# Altium schematic sheet Main_board.SchDoc
size A; SheetNumber: 1; SheetTotal: 5
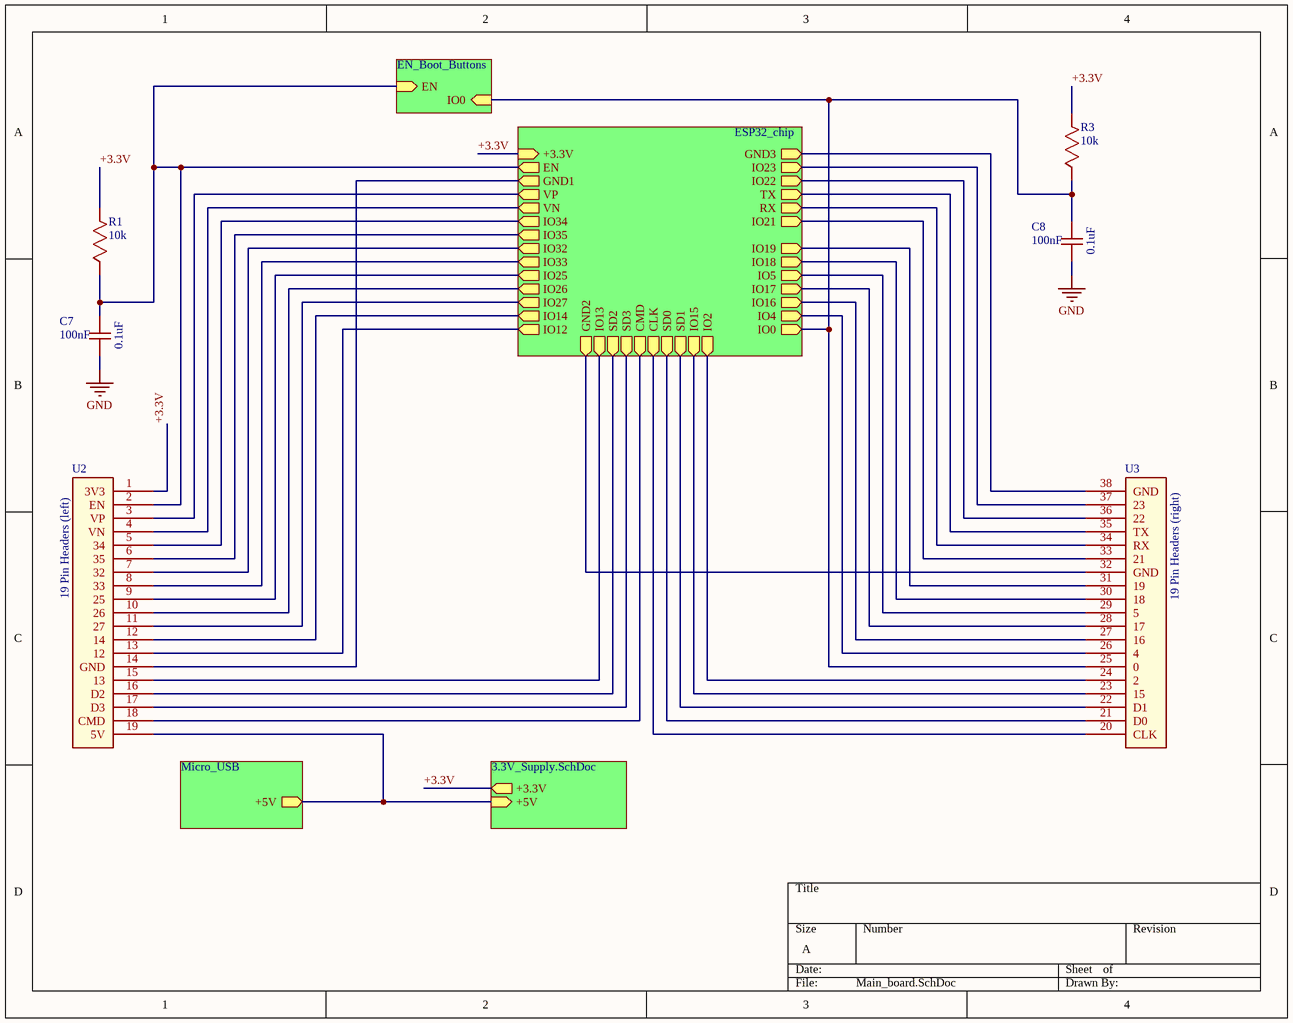
[diagram p0: Main_board.SchDoc]

## Parts
C7  100nF  [CAPC2013X140X45ML15T25]
C8  100nF  [CAPC2013X140X45ML15T25]
R1  10k  [FP-CRGCQ0805-IPC_A]
R3  10k  [FP-CRGCQ0805-IPC_A]
U2  19 Pin Headers (left)  [19 Pin headers]
U3  19 Pin Headers (right)  [19 Pin headers]

## Sub-sheets
Buttons = EN_Boot_Buttons: EN (in), IO0 (in)
Connector = Micro_USB: +5V (out)
Designator = 3.3V_Supply.SchDoc: +5V (in), +3.3V (out)
ESP32 = ESP32_chip: GND1 (out), VP (out), VN (out), IO34 (out), IO35 (out), IO32 (out), IO33 (out), IO25 (out), IO26 (out), IO27 (out), IO14 (out), IO12 (out), GND3 (out), IO23 (out), IO22 (out), TX (out), RX (out), IO21 (out), IO19 (out), IO18 (out), IO5 (out), IO17 (out), IO16 (out), IO4 (out), +3.3V (in), GND2 (out), IO13 (out), SD2 (out), SD3 (out), CMD (out), CLK (out), SD0 (out), SD1 (out), IO15 (out), IO2 (out), IO0 (out), EN (out)

## Nets
GND: C7.1 C8.1
+3.3V: R1.2 R3.2 U2.1(3V3) ; sheet ESP32/+3.3V, sheet Designator/+3.3V
NetC7_2: C7.2 R1.1 U2.2(EN) ; sheet ESP32/EN, sheet Buttons/EN
NetC8_2: C8.2 R3.1 U3.25(0) ; sheet ESP32/IO0, sheet Buttons/IO0
NetU2_3: U2.3(VP) ; sheet ESP32/VP
NetU2_4: U2.4(VN) ; sheet ESP32/VN
NetU2_5: U2.5(34) ; sheet ESP32/IO34
NetU2_6: U2.6(35) ; sheet ESP32/IO35
NetU2_7: U2.7(32) ; sheet ESP32/IO32
NetU2_8: U2.8(33) ; sheet ESP32/IO33
NetU2_9: U2.9(25) ; sheet ESP32/IO25
NetU2_10: U2.10(26) ; sheet ESP32/IO26
NetU2_11: U2.11(27) ; sheet ESP32/IO27
NetU2_12: U2.12(14) ; sheet ESP32/IO14
NetU2_13: U2.13(12) ; sheet ESP32/IO12
NetU2_14: U2.14(GND) ; sheet ESP32/GND1
NetU2_15: U2.15(13) ; sheet ESP32/IO13
NetU2_16: U2.16(D2) ; sheet ESP32/SD2
NetU2_17: U2.17(D3) ; sheet ESP32/SD3
NetU2_18: U2.18(CMD) ; sheet ESP32/CMD
NetU2_19: U2.19(5V) ; sheet Connector/+5V, sheet Designator/+5V
NetU3_20: U3.20(CLK) ; sheet ESP32/CLK
NetU3_21: U3.21(D0) ; sheet ESP32/SD0
NetU3_22: U3.22(D1) ; sheet ESP32/SD1
NetU3_23: U3.23(15) ; sheet ESP32/IO15
NetU3_24: U3.24(2) ; sheet ESP32/IO2
NetU3_26: U3.26(4) ; sheet ESP32/IO4
NetU3_27: U3.27(16) ; sheet ESP32/IO16
NetU3_28: U3.28(17) ; sheet ESP32/IO17
NetU3_29: U3.29(5) ; sheet ESP32/IO5
NetU3_30: U3.30(18) ; sheet ESP32/IO18
NetU3_31: U3.31(19) ; sheet ESP32/IO19
NetU3_32: U3.32(GND) ; sheet ESP32/GND2
NetU3_33: U3.33(21) ; sheet ESP32/IO21
NetU3_34: U3.34(RX) ; sheet ESP32/RX
NetU3_35: U3.35(TX) ; sheet ESP32/TX
NetU3_36: U3.36(22) ; sheet ESP32/IO22
NetU3_37: U3.37(23) ; sheet ESP32/IO23
NetU3_38: U3.38(GND) ; sheet ESP32/GND3

## Notes on the sheet
- (in symbol GCM21BR71E104KA37L) 0.1uF

## Library data of the parts
C7 C8 = GCM21BR71E104KA37L: Ceramic Capacitor, Ceramic, 25V, 10% +Tol, 10% -Tol, X7R, 15% TC, 0.1uF, Surface Mount, 0805; Manufacturer: Murata; Manufacturer Lifecycle Status: NRND; Supplier: DigiKey; Supplier Part Number: 490-14779-1-ND; Manufacturer Part Number: GCM21BR71E104KA37L; RoHS: Compliant; Category: Ceramic Capacitors; Stock: 12316; Pricing: 1=0.35, 10=0.208, 50=0.1528, 100=0.1358, 500=0.10726, 1000=0.09846 (USD); Value: 100nF; Case/Package: 0805; Case Code (Imperial): 0805; Case Code (Metric): 2012; Depth: 1.25mm; Dielectric: X7R; Dielectric Material: Ceramic; Height: 1.25mm; Length: 2mm; Lifecycle Status: NRND; Max Operating Temperature: 125°C; Min Operating Temperature: -55°C; Mounting Technology: Surface Mount; Number of Terminals: 2; Radiation Hardening: No; Ratings: AEC-Q200; REACH SVHC: Yes; Schedule B: 8532240020, 8532240020|8532240020|8532240020|8532240020|8532240020; Termination: SMD/SMT; Tolerance: 10%; Voltage Rating: 25V; Voltage Rating (DC): 25V; Width: 1.25mm; ComponentLink1URL: https://datasheet.octopart.com:443/GCM21BR71E104KA37L-Murata-datasheet-141268656.pdf?src-supplier=Geoflip; ComponentLink1Description: https://datasheet.octopart.com:443/GCM21BR71E104KA37L-Murata-datasheet-141268656.pdf?src-supplier=Geoflip; ComponentLink2URL: https://datasheet.octopart.com:443/GCM21BR71E104KA37L-Murata-datasheet-140660253.pdf?src-supplier=Ciiva; ComponentLink2Description: https://datasheet.octopart.com:443/GCM21BR71E104KA37L-Murata-datasheet-140660253.pdf?src-supplier=Ciiva; ComponentLink3URL: https://datasheet.octopart.com:443/GCM21BR71E104KA37L-Murata-datasheet-138719617.pdf?src-supplier=Ciiva; ComponentLink3Description: https://datasheet.octopart.com:443/GCM21BR71E104KA37L-Murata-datasheet-138719617.pdf?src-supplier=Ciiva; ComponentLink4URL: https://datasheet.octopart.com:443/GCM21BR71E104KA37L-Murata-datasheet-128592896.pdf?src-supplier=X-ON; ComponentLink4Description: https://datasheet.octopart.com:443/GCM21BR71E104KA37L-Murata-datasheet-128592896.pdf?src-supplier=X-ON; ComponentLink5URL: https://datasheet.octopart.com/GCM21BR71E104KA37L-Murata-datasheet-14404970.pdf; ComponentLink5Description: https://datasheet.octopart.com/GCM21BR71E104KA37L-Murata-datasheet-14404970.pdf; ComponentLink6URL: http://sigma.octopart.com:80/reach_statement/Murata-company-16.pdf?src-supplier=Compliance+Statements; ComponentLink6Description: http://sigma.octopart.com:80/reach_statement/Murata-company-16.pdf?src-supplier=Compliance+Statements
R1 R3 = CRGCQ0805J10K: Res Thick Film 0805 10K Ohm 5% 0.125W(1/8W) ±100ppm/C Pad SMD Automotive T/R; Manufacturer: TE Connectivity; Manufacturer Lifecycle Status: ACTIVE; Operating Supply Voltage: 150V; Power Dissipation: 125mW; Value: 10kΩ; Temperature Coefficient: 100ppm/°C; Supplier: DigiKey; Supplier Part Number: A130140CT-ND; Manufacturer Part Number: CRGCQ0805J10K; RoHS: Compliant; Category: Chip SMD Resistors; Stock: 448725; Pricing: 1=0.1, 10=0.031, 25=0.0232, 50=0.0188, 100=0.0153, 250=0.01204, 500=0.01016, 1000=0.00868 (USD); Ambient Temperature Range High: 70°C; China RoHS: Non-Compliant; Composition: Thick Film; Height: 550µm; Lifecycle Status: Production; Max Operating Temperature: 155°C; Min Operating Temperature: -55°C; Mounting Technology: Surface Mount; Number of Terminals: 2; Packaging: Cut Tape; Power Rating: 125mW; REACH SVHC: Yes; Schedule B: 8533210025, 8533210025|8533210025|8533210025|8533210025|8533210025, 8533210045; Tolerance: 5%; Voltage Rating: 150V; Voltage Rating (DC): 150V; Width: 1.25mm; Working Voltage: 150V; ComponentLink1URL: https://datasheet.octopart.com:443/CRGCQ0805J10K-TE-Connectivity-datasheet-114679081.pdf?src-supplier=Master+Electronics; ComponentLink1Description: https://datasheet.octopart.com:443/CRGCQ0805J10K-TE-Connectivity-datasheet-114679081.pdf?src-supplier=Master+Electronics; ComponentLink2URL: https://datasheet.octopart.com:443/2-2176342-5-TE-Connectivity---AMP-datasheet-189108688.pdf?src-supplier=Master+Electronics; ComponentLink2Description: https://datasheet.octopart.com:443/2-2176342-5-TE-Connectivity---AMP-datasheet-189108688.pdf?src-supplier=Master+Electronics; ComponentLink3URL: https://datasheet.octopart.com:443/CRGCQ0805J10K-TE-Connectivity-datasheet-179161841.pdf?src-supplier=IHS; ComponentLink3Description: https://datasheet.octopart.com:443/CRGCQ0805J10K-TE-Connectivity-datasheet-179161841.pdf?src-supplier=IHS; ComponentLink4URL: https://sigma.octopart.com:443/114702769/technical_drawing/TE-Connectivity-CRGCQ0805J10K.pdf?src-supplier=Sager+Electronics; ComponentLink4Description: https://sigma.octopart.com:443/114702769/technical_drawing/TE-Connectivity-CRGCQ0805J10K.pdf?src-supplier=Sager+Electronics